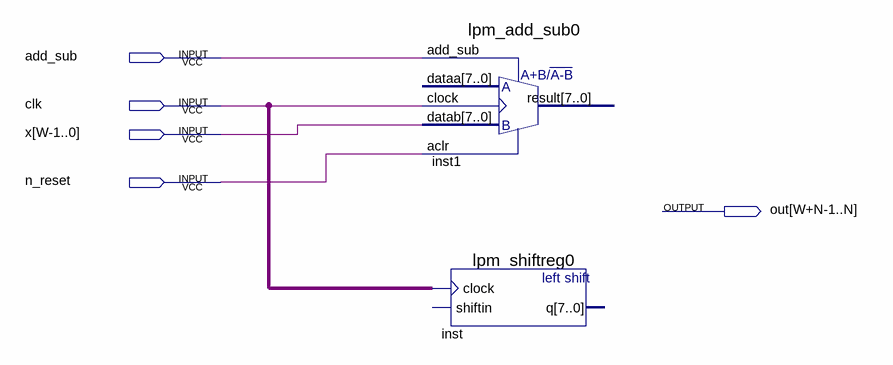
[diagram p0: schematic sheet]
// Quartus schematic _lab_8.bdf as structural Verilog: 2 symbols, 5 pins
module _lab_8 (
  input  add_sub,
  input  clk,
  input  \x[W-1..0] ,
  input  n_reset,
  output \out[W+N-1..N] 
);

  wire undriven;

  lpm_add_sub0 inst1 (.datab({8{\x[W-1..0] }}), .clock(clk), .add_sub(add_sub), .aclr(n_reset));  // open: dataa, result
  lpm_shiftreg0 inst (.clock(undriven));  // open: shiftin, q
endmodule
